# Altium schematic sheet ALLPRINT-CAPBOARD-677512-DIGITAL-OUTPUTS.SchDoc
size A3; Organization: Altium Limited; Address1: 3 Minna Close; Address2: Belrose; Address3: NSW 2085; Address4: Australia; DocumentNumber: 10; SheetNumber: 8; SheetTotal: 11
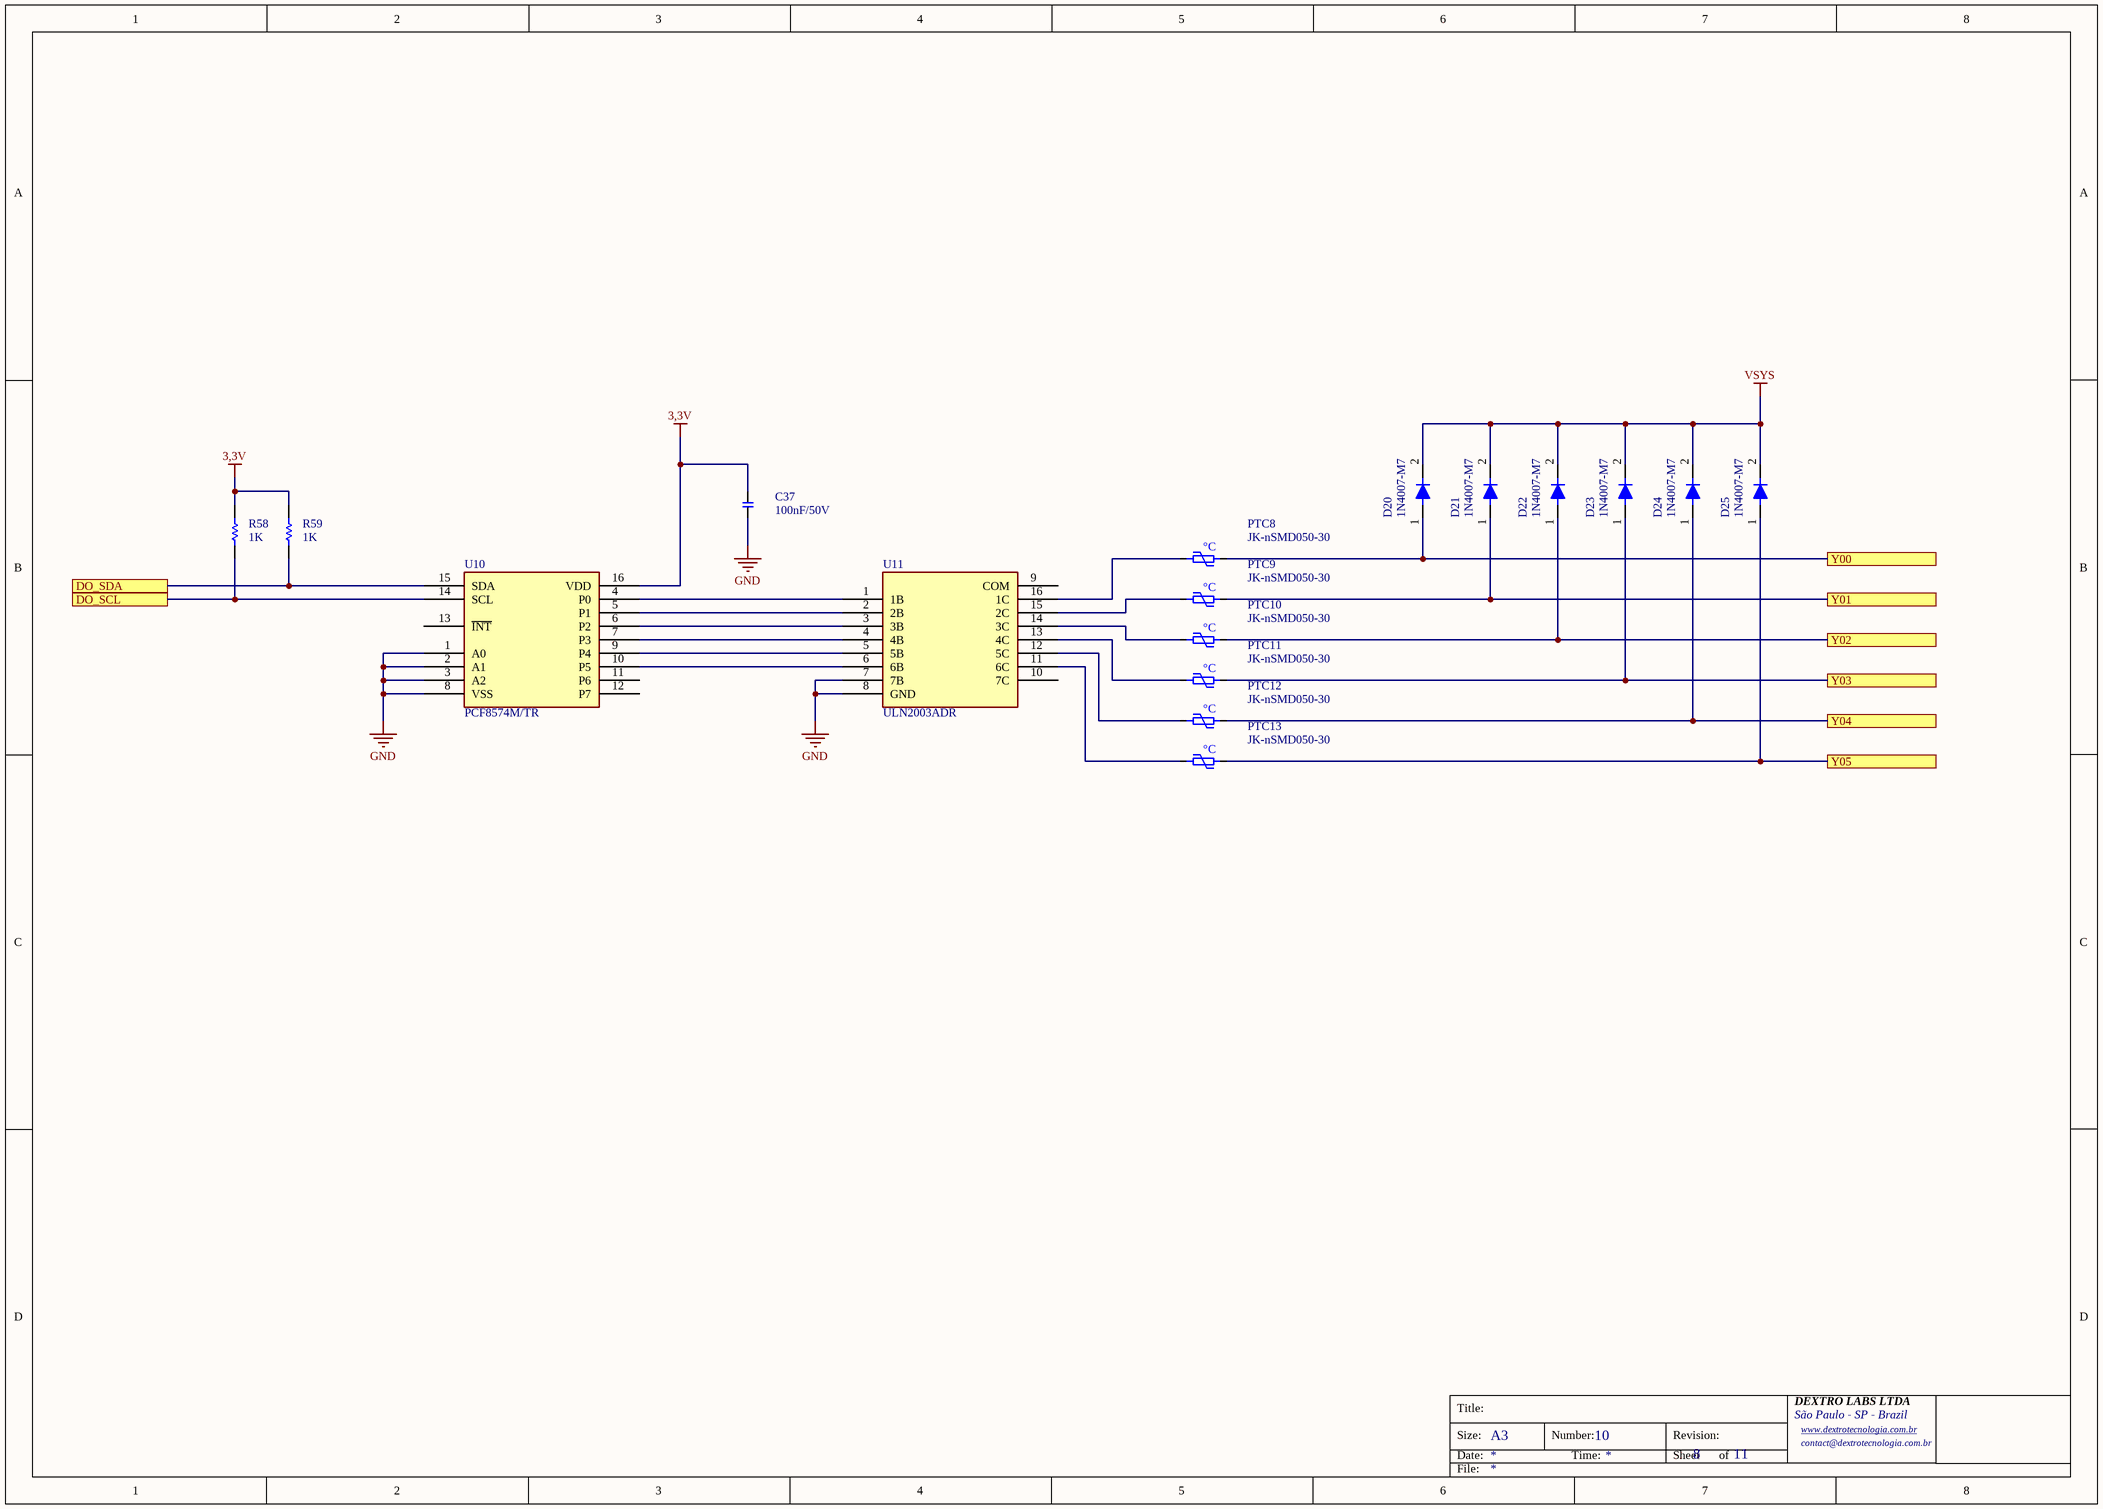
[diagram p0: ALLPRINT-CAPBOARD-677512-DIGITAL-OUTPUTS.SchDoc]

## Parts
C37  100nF/50V  [CAP-0603]
D20  1N4007-M7  [SMA]
D21  1N4007-M7  [SMA]
D22  1N4007-M7  [SMA]
D23  1N4007-M7  [SMA]
D24  1N4007-M7  [SMA]
D25  1N4007-M7  [SMA]
PTC8  JK-nSMD050-30  [PTC-1206]
PTC9  JK-nSMD050-30  [PTC-1206]
PTC10  JK-nSMD050-30  [PTC-1206]
PTC11  JK-nSMD050-30  [PTC-1206]
PTC12  JK-nSMD050-30  [PTC-1206]
PTC13  JK-nSMD050-30  [PTC-1206]
R58  1K  [RES-0603]
R59  1K  [RES-0603]
U10  PCF8574M/TR  [SOIC-16-3D]
U11  ULN2003ADR  [SOIC-16-3D]

## Ports
DO_SCL (see ALLPRINT-CAPBOARD-677512-GENERAL[3B], ALLPRINT-CAPBOARD-677512-MCU[5B]), DO_SDA (see ALLPRINT-CAPBOARD-677512-GENERAL[3A], ALLPRINT-CAPBOARD-677512-MCU[5A]), Y00 (see ALLPRINT-CAPBOARD-677512-GENERAL[4A]), Y01 (see ALLPRINT-CAPBOARD-677512-GENERAL[4B]), Y02 (see ALLPRINT-CAPBOARD-677512-GENERAL[4B]), Y03 (see ALLPRINT-CAPBOARD-677512-GENERAL[4B]), Y04 (see ALLPRINT-CAPBOARD-677512-GENERAL[4B]), Y05 (see ALLPRINT-CAPBOARD-677512-GENERAL[4B])

## Nets
3,3V: C37.2 R58.2 R59.2 U10.16(VDD)
GND: C37.1 U10.1(A0) U10.2(A1) U10.3(A2) U10.8(VSS) U11.7(7B) U11.8(GND)
VSYS: D20.2(K) D21.2(K) D22.2(K) D23.2(K) D24.2(K) D25.2(K)
DO_SCL: R58.1 U10.14(SCL) ; port DO_SCL
DO_SDA: R59.1 U10.15(SDA) ; port DO_SDA
Y00: D20.1(A1) PTC8.2 ; port Y00
Y01: D21.1(A1) PTC9.2 ; port Y01
Y02: D22.1(A1) PTC10.2 ; port Y02
Y03: D23.1(A1) PTC11.2 ; port Y03
Y04: D24.1(A1) PTC12.2 ; port Y04
Y05: D25.1(A1) PTC13.2 ; port Y05
NetPTC8_1: PTC8.1 U11.16(1C)
NetPTC9_1: PTC9.1 U11.15(2C)
NetPTC10_1: PTC10.1 U11.14(3C)
NetPTC11_1: PTC11.1 U11.13(4C)
NetPTC12_1: PTC12.1 U11.12(5C)
NetPTC13_1: PTC13.1 U11.11(6C)
NetU10_4: U10.4(P0) U11.1(1B)
NetU10_5: U10.5(P1) U11.2(2B)
NetU10_6: U10.6(P2) U11.3(3B)
NetU10_7: U10.7(P3) U11.4(4B)
NetU10_9: U10.9(P4) U11.5(5B)
NetU10_10: U10.10(P5) U11.6(6B)

Not connected (* = marked no-connect by the designer): U10 11(P6) 12(P7) 13(~{INT}); U11 9(COM) 10(7C)

## Notes on the sheet
- Title:
- Size:
- Date:
- A3
- Number:
- Time:
- Revision:
- Sheet
- of
- DEXTRO LABS LTDA
- São Paulo - SP - Brazil
- www.dextrotecnologia.com.br <http://www.dextrotecnologia.com.br>
- contact@dextrotecnologia.com.br
- File:
- (in symbol PTC-FUSE-30V-500mA-1206) °C

## Library data of the parts
C37 = CAP-100nF/50V-0603-X7R-MLCC: 50V 100nF X7R ±10% 0603 Multilayer Ceramic Capacitors MLCC - SMD/SMT ROHS; LCSC: C14663
D20-D25 = 1N4007-M7: C20754788; LCSC: C20754788
PTC8-PTC13 = PTC-FUSE-30V-500mA-1206: 30V 500mA 100A 1A 150mΩ 1206 PTC Resettable Fuses ROHS; LCSC: C720075
R58 R59 = RES-1K-1%-100mW-0603: 100mW Thick Film Resistor 75V ±100ppm/℃ ±1% 1kΩ 0603 Chip Resistor - Surface Mount ROHS; LCSC: C22548
U10 = PCF8574M/TR: 8 I2C SOP-16-150mil I/O Expanders RoHS
U11 = ULN2003ADR: 50V 500mA SOIC-16 Bipolar Transistor Arrays RoHS; LCSC: C7512